# EAGLE schematic current (EAGLE 6.4)
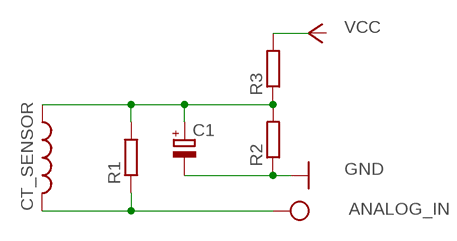
[diagram p0: schematic, sheet 1]

## Parts
C1  CPOL-EUE2.5-6  [E2,5-6]
CT_SENSOR  L-USTJ9-U2  [TJ9-U2]
R1  R-EU_0207/5V  [0207/5V]
R2  R-EU_0207/5V  [0207/5V]
R3  R-EU_0207/5V  [0207/5V]

## Nets
GND: C1.- R2.1
N$1: C1.+ CT_SENSOR.1 R1.2 R2.2 R3.1
N$2: R3.2
VCC: CT_SENSOR.2 R1.1 ; supply symbol labelled ANALOG_IN

## Library data of the parts
C1 = rcl:CPOL-EU: POLARIZED CAPACITOR, European symbol
CT_SENSOR = rcl:L-US: INDUCTOR, American symbol
R1-R3 = resistor:R-EU_: RESISTOR, European symbol